# Altium schematic sheet Modulation.SchDoc: Modulation (part 2 of 2)
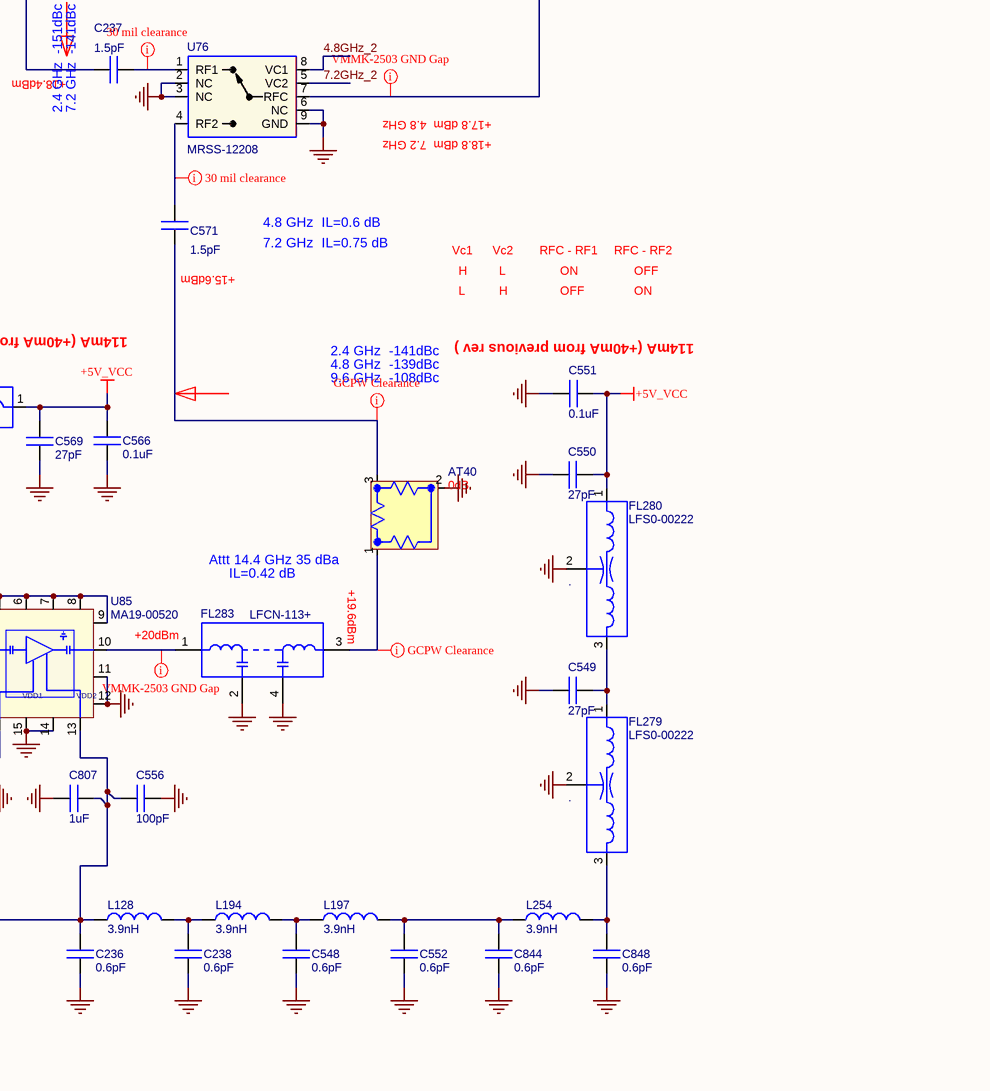
[diagram p6: Modulation.SchDoc, bottom right]

## Library data of the parts
A1_J18 = 35860: SHIELD,HYDRA,A1-J18; MFGR: Any; Approved: MH; level: 1; ModifyDate: 08/28/15; M_PN: Any; G_PN: 35860; Value: 35860; item_number: 35860
AT17 AT30 AT32-AT36 AT38 AT40 AT41 = MPFC-A1000: NoLoad: .; Approved: CL; M_PN: IMS1141-00DB; MFGR: IMS RESISTORS; level: 1; line_number: 50; ModifyDate: 4/16/13; G_PN: MPFC-A1000; item_number: MPFC-A1000
AT18 = MPFC-A1003: NoLoad: .; Approved: CL; M_PN: IMS1141-03DB; MFGR: IMS RESISTORS; level: 1; line_number: 25; G_PN: MPFC-A1003; item_number: MPFC-A1003
AT19 AT27 AT28 AT37 = MPFC-A1001: NoLoad: .; Approved: CL; M_PN: IMS1141-01DB; MFGR: IMS RESISTORS; level: 1; line_number: 15; G_PN: MPFC-A1001; item_number: MPFC-A1001
  AT27 AT28 AT37: ModifyDate: 3/8/13
AT22 AT29 AT39 = MPFC-A1002: NoLoad: .; Approved: CL; M_PN: IMS1141-02DB; MFGR: IMS RESISTORS; level: 1; line_number: 10; ModifyDate: 3/8/13; G_PN: MPFC-A1002; item_number: MPFC-A1002
AT26 = MPFC-A1009: NoLoad: .; Approved: CL; M_PN: IMS1141-09DB; MFGR: IMS RESISTORS; level: 1; line_number: 40; G_PN: MPFC-A1009; item_number: MPFC-A1009
AT73 AT74 = MPFC-B1002: NoLoad: .; Approved: CL; M_PN: IMS-2533-02DB; MFGR: IMS RESISTORS; level: 1; line_number: 1350; ModifyDate: 10/18/16; G_PN: MPFC-B1002; item_number: MPFC-B1002
C63 C237 C239 C324 C472 C475 C476 C546 C547 C562 C565 C567 C570 C571 C799 = CK41-00015: Approved: CL; NoLoad: .; M_PN: 600L1R5AT200; MFGR: ATC; level: 1; line_number: 170; G_PN: CK41-00015; ModifyDate: 02/09/13; item_number: CK41-00015
C166 C235 C349 C350 C423 C432 C487 C489 C490 C492 C494 C495 C497 C519 C535 C536 C538 C971 = CK41-00056: MFGR: ATC; M_PN: 600L5R6BT200; Approved: CL; NoLoad: .; level: 1; line_number: 120; ModifyDate: 3/11/13; G_PN: CK41-00056; item_number: CK41-00056
C236 C238 C548 C552 C844 C848 = CK41-00006: Approved: CL; NoLoad: .; M_PN: 600L0R6AT200; MFGR: ATC; level: 1; line_number: 225; G_PN: CK41-00006; ModifyDate: 02/22/12; item_number: CK41-00006
C252 C480 C481 C557 C561 = CK41-00005: Approved: CL; NoLoad: .; M_PN: 600L0R5AT200; MFGR: ATC; level: 1; line_number: 130; G_PN: CK41-00005; ModifyDate: 02/22/12; item_number: CK41-00005
C257 C261 C422 C445 C488 C493 C511 C518 C549 C550 C554 C555 C559 C560 C568 C569 = CK40-00270: MFGR: ANY; Approved: CL; NoLoad: .; level: 1; line_number: 215; ModifyDate: 02/22/12; M_PN: ANY; G_PN: CK40-00270; item_number: CK40-00270
C342-C348 C496 = CK40-00120: MFGR: ANY; Approved: CL; NoLoad: .; level: 1; line_number: 165; ModifyDate: 10/06/12; M_PN: ANY; G_PN: CK40-00120; item_number: CK40-00120
C424 C486 C491 = CK40-04100: Approved: CL; NoLoad: .; MFGR: VENKEL; M_PN: C0402X7R160-104KNP; level: 1; line_number: 95; ModifyDate: 3/29/13; G_PN: CK40-04100; item_number: CK40-04100
C434 = CK41-00015: Approved: CL; M_PN: 600L1R5AT200; MFGR: ATC; Value: 1.5pF; level: 1; line_number: 170; G_PN: CK41-00015; ModifyDate: 02/09/13; item_number: CK41-00015
C446 C448 C479 C517 C540 C545 C551 C553 C558 C566 = CK40-04100: Approved: CL; NoLoad: .; M_PN: C0402X7R160-104KNP; MFGR: VENKEL; level: 1; line_number: 95; ModifyDate: 3/29/13; G_PN: CK40-04100; item_number: CK40-04100
C447 = CK40-01470: MFGR: Any; Approved: CL; NoLoad: .; level: 1; line_number: 75; ModifyDate: 02/22/12; M_PN: Any; G_PN: CK40-01470; item_number: CK40-01470
C473 C474 C477 C478 = CK41-00056: Approved: CL; NoLoad: .; M_PN: 600L5R6BT200; MFGR: ATC; level: 1; line_number: 120; G_PN: CK41-00056; ModifyDate: 3/11/13; item_number: CK41-00056
C510 C512 = CK41-00008: NoLoad: .; MFGR: ATC; M_PN: 600L0R8AT200; Approved: CL; level: 1; line_number: 230; G_PN: CK41-00008; ModifyDate: 02/22/12; item_number: CK41-00008
C514 = CK41-00010: NoLoad: .; MFGR: ATC; M_PN: 600L1R0AT200; Approved: CL; level: 1; line_number: 220; G_PN: CK41-00010; ModifyDate: 3/7/13; item_number: CK41-00010
C516 C520 C521 C541-C544 = CK41-00024: NoLoad: .; MFGR: ATC; M_PN: 600L2R4AT200; Approved: CL; level: 1; line_number: 60; G_PN: CK41-00024; ModifyDate: 02/09/13; item_number: CK41-00024
C556 C564 C805 C819 = CK40-01100: Approved: CL; NoLoad: .; M_PN: Any; level: 1; line_number: 70; G_PN: CK40-01100; ModifyDate: 3/21/12; MFGR: Any; item_number: CK40-01100
C563 C801 C807 C824 = CK40-15100: Approved: CL; NoLoad: .; M_PN: C0402X5R160-105KNP; MFGR: VENKEL; level: 1; line_number: 227; ModifyDate: 4/23/13; G_PN: CK40-15100; item_number: CK40-15100
FL32 FL282 = MFH0-02100: MFGR: MINI-CIRCUITS; Approved: CL; Value: HFCN-2100D+; NoLoad: .; level: 1; line_number: 425; G_PN: MFH0-02100; ModifyDate: 3/14/13; item_number: MFH0-02100
FL67 FL68 = 3.6 GHz BPF: Approved: CL; level: 1; ModifyDate: 5/30/13
FL69 FL71 = 6 GHz BPF: Approved: CL; level: 1; MFGR: N/A; ModifyDate: 6/2/13; M_PN: N/A; G_PN: N/A
FL72 = 7.2_GHz_BPF: Approved: CL; level: 1; MFGR: N/A; ModifyDate: 6/2/13
FL212 FL213 FL216 FL217 FL223 FL225-FL227 FL232 FL258 FL259 FL265 FL274 FL275 FL279-FL281 FL287 FL288 FL292 FL293 = LFS0-00222: Approved: CL; NoLoad: .; M_PN: NFE31PT222Z1E9BL; MFGR: MURATA; level: 1; line_number: 335; G_PN: LFS0-00222; ModifyDate: 02/22/12; Value: 2200pF; item_number: LFS0-00222
FL220 FL224 = MFB0-02360: MFGR: MINI-CIRCUITS; Approved: NM; Value: BFCN-2360+; NoLoad: .; level: 1; line_number: 365; ModifyDate: 12/04/12; M_PN: BFCN-2360+; G_PN: MFB0-02360; item_number: MFB0-02360
FL228 FL260 FL266 FL276 = LFS0-00250: Approved: NM; NoLoad: .; M_PN: NFL18ST207X1C3; MFGR: MURATA; level: 1; line_number: 415; ModifyDate: 02/22/12; Value: 25pF; G_PN: LFS0-00250; item_number: LFS0-00250
FL231 = MFL0-03000: MFGR: MINI-CIRCUITS; Approved: CL; Value: LFCN-3000D+; NoLoad: .; level: 1; line_number: 370; G_PN: MFL0-03000; ModifyDate: 3/8/13; item_number: MFL0-03000
FL267 FL268 = MFL0-02500: MFGR: MINI-CIRCUITS; Approved: CL; Value: LFCN-2500+; NoLoad: .; level: 1; line_number: 460; G_PN: MFL0-02500; ModifyDate: 3/5/13; item_number: MFL0-02500
FL277 FL278 = MFH0-06010: MFGR: MINI-CIRCUITS; Approved: CL; Value: HFCN-6010+; NoLoad: .; level: 1; line_number: 390; G_PN: MFH0-06010; ModifyDate: 3/12/13; item_number: MFH0-06010
FL283 = MFL0-11000: MFGR: MINI-CIRCUITS; Approved: CL; Value: LFCN-113+; NoLoad: .; level: 1; line_number: 395; G_PN: MFL0-11000; ModifyDate: 3/14/13; item_number: MFL0-11000
FL285 FL289 = MFH0-04400: MFGR: MINI-CIRCUITS; Approved: CL; Value: HFCN-4400D+; NoLoad: .; level: 1; line_number: 400; G_PN: MFH0-04400; ModifyDate: 3/14/13; item_number: MFH0-04400
FL286 FL290 FL291 = MFL0-05850: NoLoad: .; Value: LFCN-5850D+; MFGR: Mini-Circuits; Approved: NM; level: 1; line_number: 405; ModifyDate: 3/15/13; M_PN: LFCN-5850D+; G_PN: MFL0-05850; item_number: MFL0-05850
FL296 FL297 = MFL1-03900: MFGR: MINI-CIRCUITS; Approved: CL; Value: LFCN-3800D+; NoLoad: .; level: 1; line_number: 470; G_PN: MFL1-03900; ModifyDate: 3/21/13; item_number: MFL1-03900
FT14 FT30 = FromToNode: level: 1; Approved: *; G_PN: *; MFGR: *; Value: *
J16 J22 = JRSM-70101: Value: B012-P93-02; MFGR: GILBERT; Approved: CL; NoLoad: .; level: 1; line_number: 480; M_PN: B012-P93-02; ModifyDate: 10/15/14; G_PN: JRSM-70101; item_number: JRSM-70101
J18 = JRSM-60101: SMPM SM MALE,STRAIGHT SMT, R/A COPLANAR, 4 PIN THRU-HOLE; Value: B012-P95-02; MFGR: GILBERT; Approved: CL; NoLoad: .; level: 1; line_number: 483; M_PN: B012-P95-02; ModifyDate: 1/6/14; G_PN: JRSM-60101; item_number: JRSM-60101
J19 = JRSM-40101: Value: 3287-6101; MFGR: SV MICROWAVE; Approved: CL; level: 1; M_PN: 3287-6101; ModifyDate: 4/10/13; G_PN: JRSM-40101; item_number: JRSM-40101
J21 = JRSM-80100: Value: B012-P93-01; MFGR: Corning Gilbert; Approved: CL; NoLoad: .; level: 1; line_number: 486; M_PN: B012-P93-01; ModifyDate: 10/15/14; G_PN: JRSM-80100; item_number: JRSM-80100
L51 = LSA5-03270: M_PN: 0603HP-27NXGLU; MFGR: COILCRAFT; NoLoad: .; Approved: CL; level: 1; line_number: 565; G_PN: LSA5-03270; ModifyDate: 3/11/13; item_number: LSA5-03270
L122 L189 L191 L192 = LSA6-03150: M_PN: 0402HP-15NXGLU; MFGR: COILCRAFT; NoLoad: .; Approved: CL; level: 1; line_number: 515; G_PN: LSA6-03150; ModifyDate: 3/8/13; item_number: LSA6-03150
L123 L125 = LSA5-03270: MFGR: COILCRAFT; NoLoad: .; Approved: CL; M_PN: 0603HP-27NXGLU; level: 1; line_number: 565; ModifyDate: 3/11/13; G_PN: LSA5-03270; item_number: LSA5-03270
L127 L168-L170 L185 L193 L195 L196 L201-L203 = LSA6-02750: M_PN: 0402HP-7N5XGLU; MFGR: COILCRAFT; NoLoad: .; Approved: CL; level: 1; line_number: 530; G_PN: LSA6-02750; ModifyDate: 3/18/13; item_number: LSA6-02750
L128 L184 L194 L197-L200 L254 = LSA6-02390: M_PN: 0402HP-3N9XGLU; MFGR: COILCRAFT; NoLoad: .; Approved: CL; level: 1; line_number: 620; G_PN: LSA6-02390; ModifyDate: 3/13/13; item_number: LSA6-02390
L186 L187 = LSA6-02560: M_PN: 0402HP-5N6XGLU; MFGR: COILCRAFT; NoLoad: .; Approved: CL; level: 1; line_number: 595; G_PN: LSA6-02560; ModifyDate: 3/4/13; item_number: LSA6-02560
L188 = LSA6-02560: INDUCTOR;5.6NH;2%;6.6GHZ SRF;105Q @1.7GHZ;.048 DCR;1.6A;0402; M_PN: 0402HP-5N6XGLU; MFGR: COILCRAFT; NoLoad: .; Approved: CL; level: 1; line_number: 595; G_PN: LSA6-02560; ModifyDate: 3/4/13; item_number: LSA6-02560
L188DC L190DC = TLW0-01220: Inductor, broadband, 0.22uH, 0.138IN long, DCR=0.10 Ohms; M_PN: BCL-221JL; MFGR: Coilcraft; Approved: XiaoXiao Zhou; level: 1; line_number: 532; Value: 0.22uH; G_PN: TLW0-01220; item_number: TLW0-01220
L190 = LSA6-03150: INDUCTOR;15NH;2%;3.9GHZ SRF;85Q @1.7GHZ;.078 DCR;1.1A;0402; M_PN: 0402HP-15NXGLU; MFGR: COILCRAFT; Approved: CL; level: 1; line_number: 515; G_PN: LSA6-03150; ModifyDate: 3/8/13; item_number: LSA6-03150
MTG32 MTG33 MTG36 MTG37 MTG45 MTG75 MTG86 MTG87 MTG89-MTG93 MTG147-MTG172 MTG178-MTG191 MTG200 = MHP200X92: level: 1; ModifyDate: 02/14/2008 14:07:19; Value: *
R17 R20 R22 R23 = RK35-00499: Approved: CL; NoLoad: .; MFGR: ANY; level: 1; line_number: 650; ModifyDate: 02/22/12; G_PN: RK35-00499; M_PN: ANY; item_number: RK35-00499
R252 R259 R389 = RK65-00392: NoLoad: .; MFGR: VISHAY/DALE; Approved: CL; M_PN: CRCW201039R2FKEF; level: 1; line_number: 892; ModifyDate: 10/14/14; G_PN: RK65-00392; item_number: RK65-00392
R255 = RK35-01210: Approved: CL; NoLoad: .; M_PN: ANY; level: 1; line_number: 770; ModifyDate: 02/22/12; MFGR: ANY; G_PN: RK35-01210; item_number: RK35-01210
R258 = RK35-01210: NoLoad: .; MFGR: ANY; Approved: CL; level: 1; line_number: 770; ModifyDate: 02/22/12; G_PN: RK35-01210; M_PN: ANY; item_number: RK35-01210
R391 R392 R398 R458-R460 = RK35-11000: NoLoad: .; Approved: CL; MFGR: ANY; level: 1; line_number: 1025; G_PN: RK35-11000; ModifyDate: 02/22/12; M_PN: ANY; item_number: RK35-11000
R396 R397 R496 R497 = RK35-03010: NoLoad: .; Approved: CL; MFGR: ANY; level: 1; line_number: 835; G_PN: RK35-03010; ModifyDate: 4/12/12; M_PN: ANY; item_number: RK35-03010
U57 U95 U103 = MA20-00006: M_PN: SKY65017-70LF; Approved: CL; MFGR: SKYWORKS; NoLoad: .; Value: SKY65017-70LF; level: 1; line_number: 1160; G_PN: MA20-00006; ModifyDate: 6/26/14; item_number: MA20-00006
U76 = MRSS-12208: M_PN: MASW-007107; NoLoad: .; Approved: NM; MFGR: MA-COM; level: 1; line_number: 1305; ModifyDate: 12/06/12; G_PN: MRSS-12208; item_number: MRSS-12208
U85 = MA19-00520: Value: HMC451LC3; NoLoad: .; Approved: CL; MFGR: HITTITE; level: 1; line_number: 1323; ModifyDate: 1/25/13; G_PN: MA19-00520; M_PN: HMC451LC3; item_number: MA19-00520
U90 U90DC U123 U123DC = MA14-00112: AMP;1-12GHz;13.5dB;+17dBm;5V;68mA;WLP-0402; Approved: NM; MFGR: AVAGO; level: 1; line_number: 1340; ModifyDate: 11/28/12; G_PN: MA14-00112; item_number: MA14-00112
  U90DC U123 U123DC: M_PN: VMMK-2503
U92 = MMDC-00310: MIXER;3-10GHZ;+17DBM;0-4GHZ IF;.118INX.118INX.036IN SMT; MFGR: HITTITE; NoLoad: .; Value: HMC787LC3B; level: 1; line_number: 1345; ModifyDate: 1/15/14; M_PN: HMC787LC3B; G_PN: MMDC-00310; item_number: MMDC-00310
U96 = MRSS-12206: MFGR: HITTITE; Approved: CL; Value: HMC849ALP4CE; NoLoad: .; level: 1; line_number: 1347; ModifyDate: 8/5/14; G_PN: MRSS-12206; item_number: MRSS-12206
U98 U122 = MA14-00112: NoLoad: .; Approved: NM; MFGR: AVAGO; level: 1; line_number: 1340; ModifyDate: 11/28/12; G_PN: MA14-00112; item_number: MA14-00112
U99 = MA19-00520: NoLoad: .; Approved: CL; MFGR: HITTITE; Value: HMC451LC3; level: 1; line_number: 1323; ModifyDate: 1/25/13; M_PN: HMC451LC3; G_PN: MA19-00520; item_number: MA19-00520
U100 = MX02-00103: M_PN: HMC188MS8E; NoLoad: .; Approved: CL; MFGR: HITTITE; Value: HMC188MS8E; level: 1; line_number: 1100; ModifyDate: 3/11/13; G_PN: MX02-00103; item_number: MX02-00103
U101 = MRSS-12004: Value: HMC284MS8GE; MFGR: HITTITE; NoLoad: .; Approved: CL; level: 1; line_number: 1105; ModifyDate: 6/1/13; M_PN: HMC284MS8GE; G_PN: MRSS-12004; item_number: MRSS-12004
U104 = MMDD-00612: MIXER;6-12GHZ;+17DBM;0-4GHZ IF;.118INX.118INX.036IN SMT; MFGR: HITTITE; NoLoad: .; Value: HMC663LC3; level: 1; line_number: 1107; ModifyDate: 9/17/13; M_PN: HMC663LC3; G_PN: MMDD-00612; item_number: MMDD-00612
U105 = MX03-00610: NoLoad: .; Approved: CL; MFGR: MINI-CIRCUITS; Value: RMK-3-14+; level: 1; line_number: 1110; ModifyDate: 3/12/13; G_PN: MX03-00610; item_number: MX03-00610
U110 = UTD3-00049: M_PN: NL27WZ04DFT2G; Value: NL27WZ04DFT2G; NoLoad: .; Approved: CL; MFGR: ON SEMI; level: 1; line_number: 1250; ModifyDate: 02/22/12; G_PN: UTD3-00049; item_number: UTD3-00049